# Altium schematic sheet Controller.SchDoc
size A; SheetNumber: 1; SheetTotal: 4
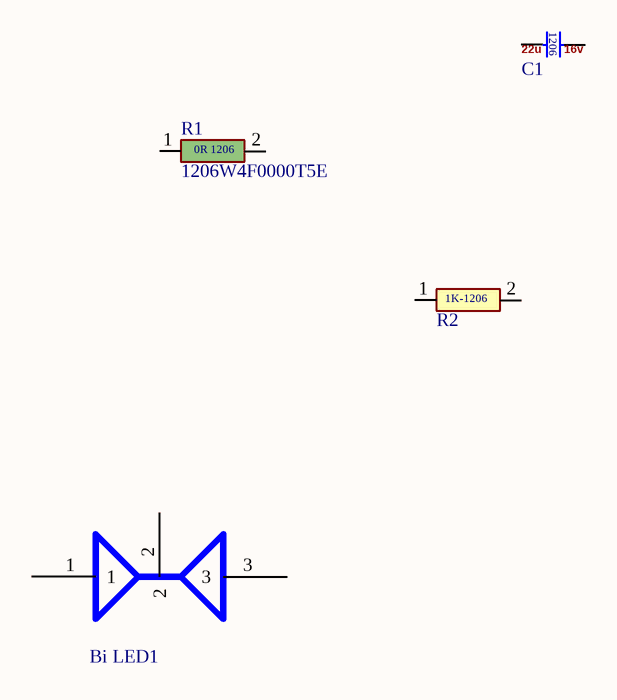
[diagram p0: Controller.SchDoc]

## Parts
Bi_LED1  Bi Directional LED  [Bi_directional_led N]  (value not drawn)
C1  CL31A226KOHNNNE  [1206-CAP]  (value not drawn)
R1  1206W4F0000T5E  [1206-RES]
R2  1206W4J0102T5E  [1206-RES]  (value not drawn)

## Nets

Not connected (* = marked no-connect by the designer): Bi_LED1 1 2 3; C1 1 2; R1 1 2; R2 1 2

## Notes on the sheet
- (in symbol 1206W4F0000T5E) 0R 1206
- (in symbol 1206W4J0102T5E) 1K-1206
- (in symbol CL31A226KOHNNNE) 1206; 22u; 16v

## Library data of the parts
Bi_LED1 = Bi Directional LED: LED: LS-2.54mm, LED dia-3mm, 2 color LED, 3 Pin
C1 = CL31A226KOHNNNE: CAP: CER 22UF 16V X5R 1206; LCSC Part #: C90146; Unit Price: 0.0178
R1 = 1206W4F0000T5E: RES: 0R JUMPER 1/4W 1206; LCSC Part #: C17888
R2 = 1206W4J0102T5E: RES: 1K OHM 5% 1/4W 1206; LCSC Part #: C1469; Unit Price: 0.0012